# EAGLE design motor_node (EAGLE 9.6.2)

## Sheet 1 of 2
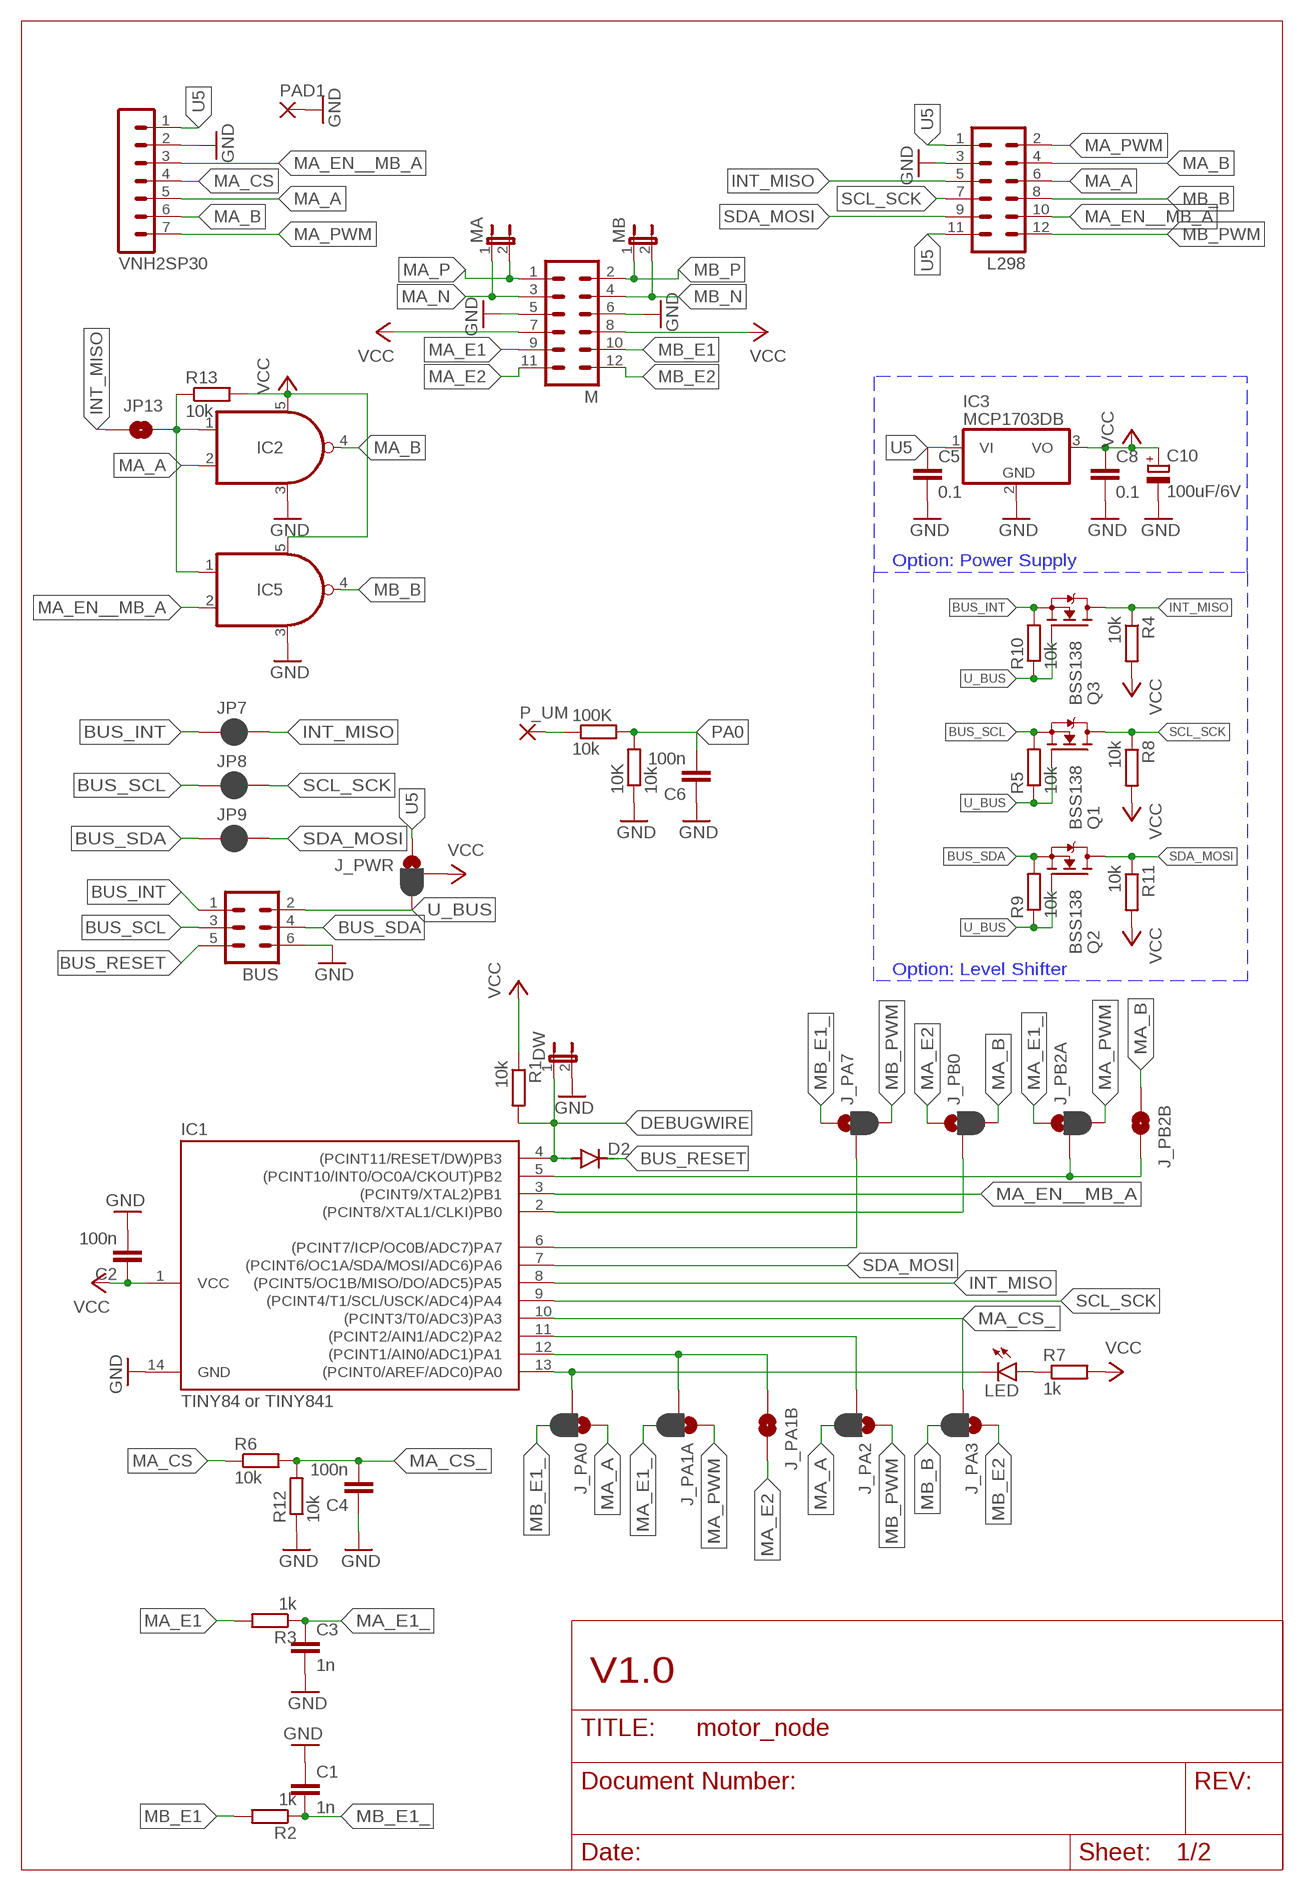
[diagram p0: schematic, sheet 1]

### Parts
10K  10k  R-EU_M0805  [M0805]
100K  10k  R-EU_M0805  [M0805]
BUS  ML6  [ML6]
C1  1n  C-EUC0805  [C0805]
C2  100n  C-EUC0805  [C0805]
C3  1n  C-EUC0805  [C0805]
C4  100n  C-EUC0805  [C0805]
C5  0.1  C-EUC0805  [C0805]
C6  100n  C-EUC0805  [C0805]
C8  0.1  C-EUC0805  [C0805]
C10  100uF/6V  CPOL-EUB/3528-21R  [B/3528-21R]
D2  DIODE-MINIMELF  [MINIMELF]
DW  JP1E  [JP1]
IC1  TINY84 or TINY841  TINY24/44/84-SSU  [SOIC14]
IC2  AHC00-DB  [SOT-23/5]
IC3  MCP1703DB  [SOT223]
IC5  AHC00-DB  [SOT-23/5]
J_PA0  JUMPER-SMT_3_1-NC_PASTE_NO-SILK  [SMT-JUMPER_3_1-NC_PASTE_NO-SILK]
J_PA1A  JUMPER-SMT_3_1-NC_PASTE_NO-SILK  [SMT-JUMPER_3_1-NC_PASTE_NO-SILK]
J_PA1B  JUMPER-SMT_2_NO_NO-SILK  [SMT-JUMPER_2_NO_NO-SILK]
J_PA2  JUMPER-SMT_3_1-NC_PASTE_NO-SILK  [SMT-JUMPER_3_1-NC_PASTE_NO-SILK]
J_PA3  JUMPER-SMT_3_1-NC_PASTE_NO-SILK  [SMT-JUMPER_3_1-NC_PASTE_NO-SILK]
J_PA7  JUMPER-SMT_3_1-NC_PASTE_NO-SILK  [SMT-JUMPER_3_1-NC_PASTE_NO-SILK]
J_PB0  JUMPER-SMT_3_1-NC_PASTE_NO-SILK  [SMT-JUMPER_3_1-NC_PASTE_NO-SILK]
J_PB2A  JUMPER-SMT_3_1-NC_PASTE_NO-SILK  [SMT-JUMPER_3_1-NC_PASTE_NO-SILK]
J_PB2B  JUMPER-SMT_2_NO_NO-SILK  [SMT-JUMPER_2_NO_NO-SILK]
J_PWR  JUMPER-SMT_3_1-NC_PASTE_NO-SILK  [SMT-JUMPER_3_1-NC_PASTE_NO-SILK]
JP7  JUMPER-SMT_2_NC_PASTE_NO-SILK  [SMT-JUMPER_2_NC_PASTE_NO-SILK]
JP8  JUMPER-SMT_2_NC_PASTE_NO-SILK  [SMT-JUMPER_2_NC_PASTE_NO-SILK]
JP9  JUMPER-SMT_2_NC_PASTE_NO-SILK  [SMT-JUMPER_2_NC_PASTE_NO-SILK]
JP13  JUMPER-SMT_2_NO_NO-SILK  [SMT-JUMPER_2_NO_NO-SILK]
L298  MA06-2  [MA06-2]
LED  LEDCHIPLED_0805  [CHIPLED_0805]
M  MA06-2  [MA06-2]
MA  JP1E  [JP1]
MB  JP1E  [JP1]
P_UM  1,6/0,8  [1,6/0,8]
PAD1  2,54/0,8  [2,54/0,8]
Q1  BSS138  [SOT23]
Q2  BSS138  [SOT23]
Q3  BSS138  [SOT23]
R1  10k  R-EU_M0805  [M0805]
R2  1k  R-EU_M0805  [M0805]
R3  1k  R-EU_M0805  [M0805]
R4  10k  R-EU_M0805  [M0805]
R5  10k  R-EU_R0805  [R0805]
R6  10k  R-EU_M0805  [M0805]
R7  1k  R-EU_R0603  [R0603]
R8  10k  R-EU_M0805  [M0805]
R9  10k  R-EU_R0805  [R0805]
R10  10k  R-EU_R0805  [R0805]
R11  10k  R-EU_M0805  [M0805]
R12  10k  R-EU_M0805  [M0805]
R13  10k  R-EU_R0805  [R0805]
VNH2SP30  MA07-1  [MA07-1]

### Nets
BUS_INT: BUS.1 JP7.1 Q3.2(S) R10.2
BUS_RESET: BUS.5 D2.C
BUS_SCL: BUS.3 JP8.1 Q1.2(S) R5.2
BUS_SDA: BUS.4 JP9.1 Q2.2(S) R9.2
DEBUGWIRE: D2.A DW.1 IC1.4((PCINT11/RESET/DW)PB3) R1.2
GND: 10K.1 BUS.6 C1.1 C2.2 C3.2 C4.1 C5.2 C6.1 C8.2 C10.- DW.2 IC1.14(GND) IC2.3(GND) IC3.2(GND) IC5.3(GND) L298.3 M.5 M.6 PAD1.1(P) R12.1 VNH2SP30.2
INT_MISO: IC1.8((PCINT5/OC1B/MISO/DO/ADC5)PA5) JP7.2 JP13.1 L298.5 Q3.3(D) R4.1
MA_A: IC2.2(I1) J_PA0.1 J_PA2.3 L298.6 VNH2SP30.5
MA_B: IC2.4(O) J_PB0.3 J_PB2B.1 L298.4 VNH2SP30.6
MA_CS: R6.1 VNH2SP30.4
MA_CS_: C4.2 IC1.10((PCINT3/T0/ADC3)PA3) J_PA3.2 R6.2 R12.2
MA_E1: M.9 R3.2
MA_E1_: C3.1 J_PA1A.3 J_PB2A.1 R3.1
MA_E2: J_PA1B.2 J_PB0.1 M.11
MA_EN__MB_A: IC1.3((PCINT9/XTAL2)PB1) IC5.2(I1) L298.10 VNH2SP30.3
MA_N [power]: M.3 MA.1
MA_P [power]: M.1 MA.2
MA_PWM: J_PA1A.1 J_PB2A.3 L298.2 VNH2SP30.7
MB_B: IC5.4(O) J_PA3.3 L298.8
MB_E1: M.10 R2.2
MB_E1_: C1.2 J_PA0.3 J_PA7.1 R2.1
MB_E2: J_PA3.1 M.12
MB_N [power]: M.4 MB.2
MB_P [power]: M.2 MB.1
MB_PWM: J_PA2.1 J_PA7.3 L298.12
N$2: 100K.1 P_UM.1(P)
N$4: IC2.1(I0) IC5.1(I0) JP13.2 R13.1
N$6: LED.A R7.1
PA0: 10K.2 100K.2 C6.2 IC1.13((PCINT0/AREF/ADC0)PA0) J_PA0.2 LED.C
PA1: IC1.12((PCINT1/AIN0/ADC1)PA1) J_PA1A.2 J_PA1B.1
PA2: IC1.11((PCINT2/AIN1/ADC2)PA2) J_PA2.2
PA7: IC1.6((PCINT7/ICP/OC0B/ADC7)PA7) J_PA7.2
PB0: IC1.2((PCINT8/XTAL1/CLKI)PB0) J_PB0.2
PB2: IC1.5((PCINT10/INT0/OC0A/CKOUT)PB2) J_PB2A.2 J_PB2B.2
SCL_SCK: IC1.9((PCINT4/T1/SCL/USCK/ADC4)PA4) JP8.2 L298.7 Q1.3(D) R8.1
SDA_MOSI: IC1.7((PCINT6/OC1A/SDA/MOSI/ADC6)PA6) JP9.2 L298.9 Q2.3(D) R11.1
U5: C5.1 IC3.1(VI) J_PWR.1 L298.1 L298.11 VNH2SP30.1
U_BUS: BUS.2 J_PWR.3 Q1.1(G) Q2.1(G) Q3.1(G) R5.1 R9.1 R10.1
VCC: C2.1 C8.1 C10.+ IC1.1(VCC) IC2.5(VDD) IC3.3(VO) IC5.5(VDD) J_PWR.2 M.7 M.8 R1.1 R4.2 R7.2 R8.2 R11.2 R13.2

### Notes on the sheet
- Option: Power Supply
- Option: Level Shifter
- V1.0

## Sheet 2 of 2

## Library data of the parts
10K 100K R1-R4 R6-R8 R11 R12 = rcl:R-EU_: RESISTOR, European symbol; SPICEPREFIX: R
BUS = con-harting-ml:ML6: HARTING; OC_FARNELL: unknown; OC_NEWARK: unknown
C1-C6 C8 = rcl:C-EU: CAPACITOR, European symbol
C10 = rcl:CPOL-EU: POLARIZED CAPACITOR, European symbol
D2 = diode:DIODE-: DIODE
DW MA MB = jumper:JP1E: JUMPER
IC1 = avr-7:TINY24/44/84
IC2 IC5 = picogate:AHC00: Two input NAND gate
IC3 = linear:MCP1703: 250 mA, 16V, Low Quiescent Current LDO Regulator Source: http://ww1.microchip.com/downloads/en/DeviceDoc/22049b.pdf
J_PA0 J_PA1A J_PA2 J_PA3 J_PA7 J_PB0 J_PB2A J_PWR = SparkFun-Jumpers:JUMPER-SMT_3_1-NC_PASTE: Normally closed solder jumper (1 of 2 connections) This jumper has an aperture in the stencil to allow solder paste to bridge one of the two connections. One connection is normally closed (NC), while the other is normally open (NO). Wick off the solder to open the connection. Reapply solder to reclose the connection. Apply solder to the other side instead to change the current path.
J_PA1B J_PB2B JP13 = SparkFun-Jumpers:JUMPER-SMT_2_NO: Normally open jumper This jumper has two pads in close proximity to each other. Apply solder to close the connection. Round pads are easier to solder for beginners, but are a lot larger. SparkFun Product that uses the round pads: SparkFun EL Sequencer <https://www.sparkfun.com/products/12781>
JP7-JP9 = SparkFun-Jumpers:JUMPER-SMT_2_NC_PASTE: Normally closed solder jumper This jumper has an aperture in the stencil to allow solder paste to bridge the split in the wire so it's normally closed (NC). Wick off the solder to open the connection. Reapply solder to reclose the connection.
L298 M = con-lstb:MA06-2: PIN HEADER; OC_FARNELL: unknown; OC_NEWARK: unknown
LED = led:LED: LED OSRAM: - CHIPLED LG R971, LG N971, LY N971, LG Q971, LY Q971, LO R971, LY R971 LH N974, LH R974 LS Q976, LO Q976, LY Q976 LO Q996 - Hyper CHIPLED LW Q18S LB Q993, LB Q99A, LB R99A - SideLED LS A670, LO A670, LY A670, LG A670, LP A670 LB A673, LV A673, LT A673, LW A673 LH A674 LY A675 LS A676, LA A676, LO A676, LY A676, LW A676 LS A679, LY A679, LG A679 - Hyper Micro SIDELED® LS Y876, LA Y876, LO Y876, LY Y876 LT Y87S - SmartLED LW L88C, LW L88S LB L89C, LB L89S, LG L890 LS L89K, LO L89K, LY L89K LS L896, LA L896, LO L896, LY L896 - TOPLED LS T670, LO T670, LY T670, LG T670, LP T670 LSG T670, LSP T670, LSY T670, LOP T670, LYG T670 LG T671, LOG T671, LSG T671 LB T673, LV T673, LT T673, LW T673 LH T674 LS T676, LA T676, LO T676, LY T676, LB T676, LH T676, LSB T676, LW T676 LB T67C, LV T67C, LT T67C, LS T67K, LO T67K, LY T67K, LW E67C LS E67B, LA E67B, LO E67B, LY E67B, LB E67C, LV E67C, LT E67C LW T67C LS T679, LY T679, LG T679 LS T770, LO T770, LY T770, LG T770, LP T770 LB T773, LV T773, LT T773, LW T773 LH T774 LS E675, LA E675, LY E675, LS T675 LS T776, LA T776, LO T776, LY T776, LB T776 LHGB T686 LT T68C, LB T68C - Hyper Mini TOPLED® LB M676 - Mini TOPLED Santana® LG M470 LS M47K, LO M47K, LY M47K Source: http://www.osram.convergy.de LUXEON: - LUMILED® LXK2-PW12-R00, LXK2-PW12-S00, LXK2-PW14-U00, LXK2-PW14-V00 LXK2-PM12-R00, LXK2-PM12-S00, LXK2-PM14-U00 LXK2-PE12-Q00, LXK2-PE12-R00, LXK2-PE12-S00, LXK2-PE14-T00, LXK2-PE14-U00 LXK2-PB12-K00, LXK2-PB12-L00, LXK2-PB12-M00, LXK2-PB14-N00, LXK2-PB14-P00, LXK2-PB14-Q00 LXK2-PR12-L00, LXK2-PR12-M00, LXK2-PR14-Q00, LXK2-PR14-R00 LXK2-PD12-Q00, LXK2-PD12-R00, LXK2-PD12-S00 LXK2-PH12-R00, LXK2-PH12-S00 LXK2-PL12-P00, LXK2-PL12-Q00, LXK2-PL12-R00 Source: www.luxeon.com KINGBRIGHT: KA-3528ASYC Source: www.kingbright.com
P_UM = wirepad:1,6/0,8: THROUGH-HOLE PAD
PAD1 = wirepad:2,54/0,8: THROUGH-HOLE PAD
Q1-Q3 = bss138_10:BSS138: BSS138 N-Channel Logic Level Enhancement Mode Field Effect Transistor Source: http://www.fairchildsemi.com/datasheets/BS/BSS138.pdf; MF: Fairchild; MPN: BSS138; OC_FARNELL: 9845330; OC_NEWARK: 67R2009
R5 R9 R10 R13 = rcl:R-EU_: RESISTOR, European symbol
VNH2SP30 = con-lstb:MA07-1: PIN HEADER; OC_FARNELL: unknown; OC_NEWARK: unknown

## Net classes
1 gnd: width 0.381 mm, drill 0.381 mm
2 power: width 0.762 mm, drill 0.762 mm

## Board
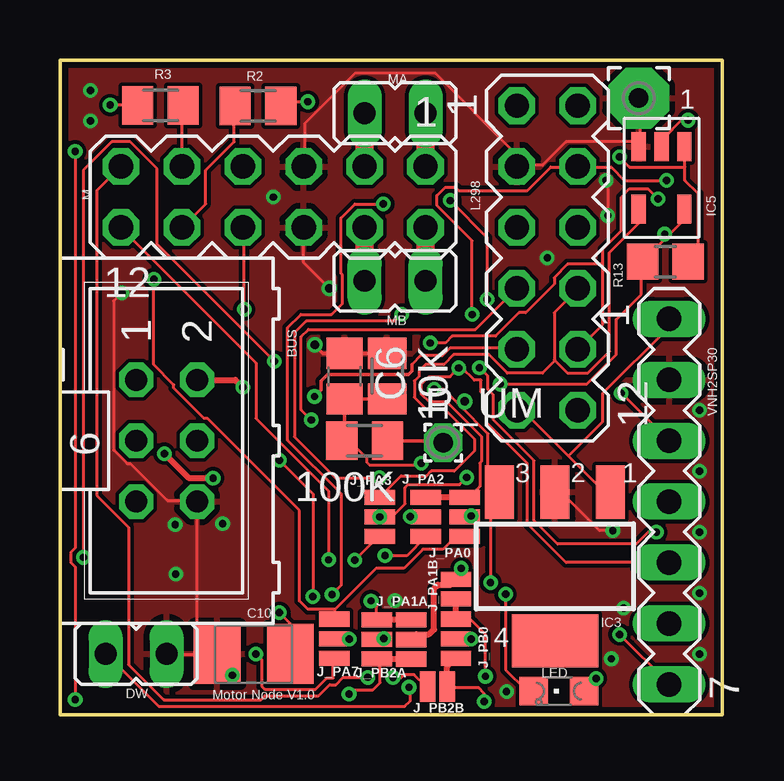
[diagram p1: board, top side]
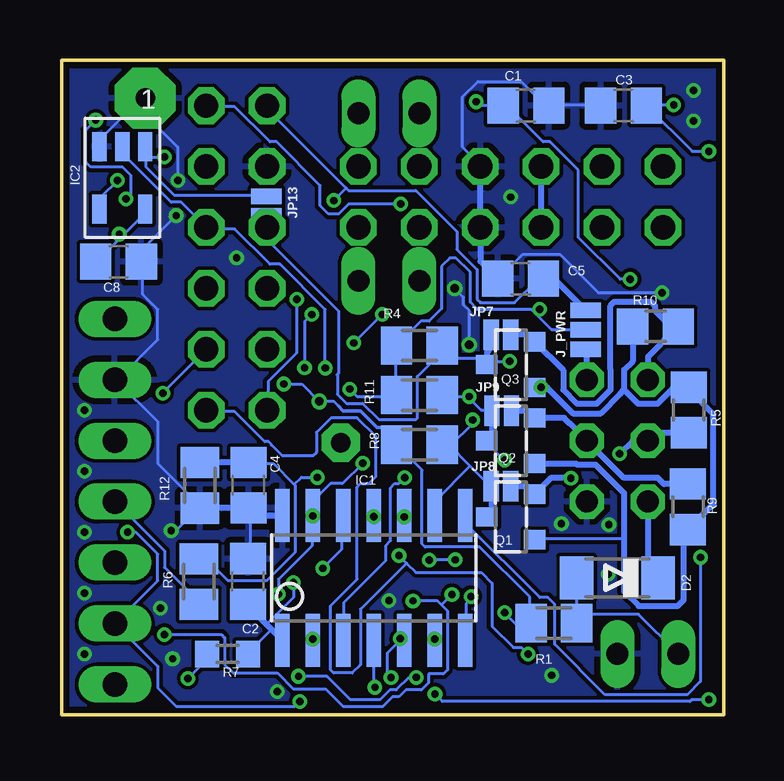
[diagram p2: board, bottom side, seen from below]

Size 27.62 x 27.3 mm. Coordinates in mm from the lower left corner, seen from the top.
Outline: 0,0 27.61,0 27.61,27.3 0,27.3 0,0
Outline: 0,0 27.62,0 27.62,27.3 0,27.3 0,0
Copper layers (1*16): Top 0.035mm / dielectric 1.5mm / Bottom 0.035mm
Design rules "eagle": minimum track width 5mil, minimum drill 12mil, track to track 6mil, track to pad 6mil, pad to pad 6mil, via to via 6mil, smd to smd 0mil, copper to edge 10mil, drill to drill 10mil, minimum pad ring 10mil, minimum via ring 6mil, stop-mask expansion 2mil, vias tented up to drill 25mil, thermal gap 10mil

### Footprints (pad centres in the part's own frame; a part is rotated, then mirrored left to right if it is on the bottom)
M0805 = smd 1.3 x 1.6: 1 -0.95,0; 2 0.95,0
ML6 = drill 0.914 octagon: 1 -2.54,-1.27; 2 -2.54,1.27; 3 0,-1.27; 4 0,1.27; 5 2.54,-1.27; 6 2.54,1.27
C0805 = smd 1.3 x 1.5: 1 -0.95,0; 2 0.95,0
B/3528-21R = smd 1.95 x 2.5: + 1.525,0; - -1.525,0
MINIMELF = smd 1.4 x 1.8: A 1.7,0; C -1.7,0
JP1 = drill 0.914 long: 1 0,-1.27; 2 0,1.27
SOIC14 = smd 0.61 x 2.21: 1 -3.81,-2.603; 2 -2.54,-2.603; 3 -1.27,-2.603; 4 0,-2.603; 5 1.27,-2.603; 6 2.54,-2.603; 7 3.81,-2.603; 8 3.81,2.603; 9 2.54,2.603; 10 1.27,2.603; 11 0,2.603; 12 -1.27,2.603; 13 -2.54,2.603; 14 -3.81,2.603
SOT-23/5 = smd 0.6 x 1.2: 1 -0.95,-1.306; 2 0,-1.306; 3 0.95,-1.306; 4 0.95,1.306; 5 -0.95,1.306
SOT223 = smd 1.219 x 2.235: 1 -2.311,-3.099; 2 0,-3.099; 3 2.311,-3.099 | smd 3.6 x 2.2: 4 0,3.099
SMT-JUMPER_3_1-NC_PASTE_NO-SILK = smd 0.635 x 1.27: 1 -0.813,0; 2 0,0; 3 0.813,0
SMT-JUMPER_2_NO_NO-SILK = smd 0.635 x 1.27: 1 -0.406,0; 2 0.406,0
SMT-JUMPER_2_NC_PASTE_NO-SILK = smd 0.635 x 1.27: 1 -0.406,0; 2 0.406,0
MA06-2 = drill 1.016 octagon: 1 -6.35,-1.27; 2 -6.35,1.27; 3 -3.81,-1.27; 4 -3.81,1.27; 5 -1.27,-1.27; 6 -1.27,1.27; 7 1.27,-1.27; 8 1.27,1.27; 9 3.81,-1.27; 10 3.81,1.27; 11 6.35,-1.27; 12 6.35,1.27
CHIPLED_0805 = smd 1.2 x 1.2: A 0,-1.05; C 0,1.05
1,6/0,8 = drill 0.813 pad 1.6 octagon: 1 0,0
2,54/0,8 = drill 0.813 pad 2.54 octagon: 1 0,0
SOT23 = smd 0.8 x 0.9: 1 -0.95,-1; 2 0.95,-1; 3 0,1
R0805 = smd 1.3 x 1.5: 1 -0.95,0; 2 0.95,0
R0603 = smd 1 x 1.1: 1 -0.85,0; 2 0.85,0
MA07-1 = drill 1.016 long: 1 -7.62,0; 2 -5.08,0; 3 -2.54,0; 4 0,0; 5 2.54,0; 6 5.08,0; 7 7.62,0

### Placement (x,y rotation side)
10K  13.64,14.12 270 top
100K  12.7,11.43 180 top
BUS  4.45,11.43 270 top
C1  8.26,25.4 180 bottom
C2  19.85,5.56 90 bottom
C3  4.19,25.41 180 bottom
C4  19.83,9.58 90 bottom
C5  8.48,18.19 180 bottom
C6  11.86,14.12 270 top
C8  25.24,18.89 0 bottom
C10  8.08,2.54 0 top
D2  4.45,5.71 180 bottom
DW  3.17,2.54 270 top
IC1  14.61,5.71 0 bottom
IC2  25.08,22.39 180 bottom
IC3  20.64,6.19 180 top
IC5  25.08,22.39 180 top
J_PA0  16.87,8.26 270 top
J_PA1A  14.64,3.14 270 top
J_PA1B  16.51,5.24 270 top
J_PA2  15.24,8.26 90 top
J_PA3  13.34,8.26 90 top
J_PA7  11.43,3.17 270 top
J_PB0  16.51,3.17 270 top
J_PB2A  13.21,3.15 90 top
J_PB2B  15.74,1.18 180 top
J_PWR  5.77,16.05 270 bottom
JP7  9.3,15.85 180 bottom
JP8  9.3,9.53 180 bottom
JP9  9.27,12.67 180 bottom
JP13  19.08,21.21 90 bottom
L298  20.32,19.05 270 top
LED  20.8,0.99 90 top
M  8.89,21.59 180 top
MA  13.97,25.08 270 top
MB  13.97,18.1 90 top
P_UM  15.98,11.35 0 top
PAD1  24.13,25.72 0 top
Q1  8.89,8.26 90 bottom
Q2  8.89,11.43 90 bottom
Q3  8.89,14.61 90 bottom
R1  7.09,3.82 0 bottom
R2  8.26,25.39 180 top
R3  4.19,25.41 0 top
R4  12.7,15.4 180 bottom
R5  1.47,12.71 270 bottom
R6  21.89,5.56 90 bottom
R7  20.7,2.54 0 bottom
R8  12.7,11.27 180 bottom
R9  1.5,8.67 90 bottom
R10  2.86,16.19 0 bottom
R11  12.7,13.34 180 bottom
R12  21.85,9.57 90 bottom
R13  25.24,18.89 180 top
VNH2SP30  25.4,8.89 270 top

### Tracks (layer width: path | path; a pad name or v marks a point on that pad's centre or on a via)
BUS_INT
  Bottom 0.254: R10.2 2.06,16.04 | 2.06,16.04 3.17,14.93 BUS.1 | 2.06,16.04 2.88,16.85 2.88,17.06 3.04,17.22 4.57,17.22 4.74,17.06 4.74,14.39 4.72,14.38 4.72,13.56 5.3,12.98 6.12,12.98 6.71,13.56 6.71,14.37 Q3.2 8.19,15.85 JP7.1
BUS_RESET
  Bottom 0.254: BUS.5 3.17,6.14 D2.C
BUS_SCL  (via drill 0.3)
  Top 0.254: v4.35,10.89 5.36,9.88 6.12,9.88 6.13,9.87 v6.38,9.87
  Bottom 0.254: R5.2 2.84,11.76 BUS.3 3.81,11.43 v4.35,10.89 | JP8.1 8.21,9.53 Q1.2 7.22,9.87 v6.38,9.87
BUS_SDA
  Bottom 0.254: R9.2 2.51,9.62 2.77,9.88 4.17,9.88 BUS.4 6.45,12.17 6.46,12.17 6.67,12.38 Q2.2 8.19,12.68 JP9.1
DEBUGWIRE  (via drill 0.3)
  Top 0.127: DW.1 1.96,2.52 4.12,0.35 14.37,0.35 14.61,0.58 14.61,1.1 v14.55,1.15
  Bottom 0.127: 6.15,4.19 6.15,5.66 D2.A | 6.15,4.19 6.15,3.84 R1.2 6.15,4.19 | 6.15,4.19 3.56,4.19 1.96,2.58 DW.1 | IC1.4 14.61,1.2 v14.55,1.15
GND  (via drill 0.3, 0.35)
  Top 0.127: IC3.2 20.89,9.29 22.49,7.68 v23.05,7.68 | 5.73,2.52 4.47,2.52 DW.2 | 5.73,2.52 6.5,2.52 C10.- | 5.73,2.52 5.73,8.87 BUS.6 5.66,8.94 4.47,8.94 2.93,10.48 2.79,10.48 2.23,11.04 2.23,17.25 v2.58,17.6 | 5.73,2.52 C10.- | 24.17,23.89 24.17,25.7 PAD1.1 | 24.17,23.89 24.17,23.75 IC5.3 24.17,23.89 | 24.17,23.89 21.09,23.89 20.12,22.91 19.07,22.91 L298.3 19,22.91 19,23.4 15.65,26.75 12.29,26.75 10.2,24.66 10.2,22.91 M.5 | v22.84,20.82 22.84,22.21 v22.77,22.28 | C10.- 7.19,1.9 v7.19,1.65 | v11.23,17.78 10.16,18.85 M.6
  Top 0.15: 10K.1 C6.1 10.98,15.07 v10.62,15.43
  Bottom 0.127: C2.2 19.77,6.64 19.77,8.03 19.56,8.24 C4.1 | v23.05,7.68 22.84,7.68 21.93,8.59 R12.1 21.86,8.73 23.61,10.48 23.61,12.22 25.36,13.97 VNH2SP30.2 25.29,13.97 23.61,15.65 23.61,16.9 24.24,17.53 24.24,18.86 C8.2 24.24,18.93 24.24,19.42 v22.84,20.82 | C3.2 5.17,25.43 7.26,25.43 C1.1 7.33,25.43 7.47,25.43 8.45,26.4 10.27,26.4 10.9,25.77 10.9,23.68 10.2,22.98 M.5 | IC2.3 25.98,23.75 25.98,24.03 24.31,25.7 24.17,25.7 PAD1.1 24.52,25.43 22.77,23.68 v22.77,22.28 | v2.58,17.6 5.24,17.6 6.84,19.21 8.38,19.21 9.36,18.23 C5.2 | v10.62,15.43 10.62,16.85 10.86,17.09 10.86,17.41 v11.23,17.78
  Bottom 0.254: M.5 M.6 10.16,18.91 C5.2 | IC1.14 19.52,8.32 C4.1 R12.1
  other vias: 4.83,5.87 4.8,7.92 6.78,7.98 1.27,24.77 1.27,26.04 8.89,21.59 20.32,19.05 26.67,12.7 26.67,10.16 26.67,7.62 26.67,5.08 26.67,2.54 13.97,4.76 18.62,0.97 22.99,2.34 23.5,4.45
  pour Top: 0,0 27.62,0 27.62,27.3 0,27.3
  pour Bottom: 0,0 27.62,0 27.62,27.3 0,27.3
INT_MISO  (via drill 0.3)
  Top 0.127: v0.98,6.57 0.98,22.7 2.17,23.89 2.93,23.89 4.05,22.77 4.05,19.63 v8.94,14.74
  Bottom 0.127: JP7.2 9.7,15.27 9.93,14.88 11.5,14.88 R4.1 11.8,15.37 11.8,15.09 12.78,14.11 12.78,12.65 12.78,12.37 12.83,12.32 14.39,12.32 15.06,12.99 15.75,12.99 16.12,13.37 16.12,14.17 16.14,14.18 16.07,14.25 16.07,16.83 19,19.77 19,20.26 L298.5 | v0.98,6.57 0.98,1.4 1.54,0.84 4.96,0.84 7.05,2.93 7.05,4.61 7.33,4.89 7.68,4.89 10.76,7.96 10.76,8.31 IC1.8 | v8.94,14.74 9.78,14.74 Q3.3
  Bottom 0.254: JP7.2 9.89,15.66 Q3.3 | L298.5 19.05,20.78 JP13.1
MA_A  (via drill 0.3)
  Top 0.127: VNH2SP30.5 25.36,6.36 21.09,6.36 19.49,7.96 19.49,10.48 17.79,12.18 17.79,13.23 17.56,13.46 17.56,13.96 17.27,13.96 16.77,14.46 v16.62,14.46 16.27,14.1 15.39,14.1 15.08,13.8 15.08,13.37 15.4,13.05 16.13,13.05 17.57,11.6 17.57,10.57 17.5,10.5 17.5,9.53 17.04,9.07 J_PA0.1 16.51,9.07
  Top 0.254: 16.51,9.07 J_PA2.3
  Bottom 0.127: IC2.2 25.08,23.68 25.08,23.4 23.05,21.37 22.63,21.37 L298.6 21.58,20.26 20.4,20.26 18.93,18.79 18.51,18.79 16.62,16.9 v16.62,14.46
MA_B  (via drill 0.3)
  Top 0.127: v25.29,22.28 23.54,22.28 22.98,22.84 21.65,22.84 L298.4 21.58,22.84 20.47,22.84 19.49,21.86 16.62,21.86 16.48,22 16.07,22 15.72,21.65 15.72,21.23 17.18,19.77 v17.18,16.69 | v17.68,0.56 17.68,0.9 17.46,1.12 16.2,1.12 J_PB2B.1 | v24.87,7.61 24.52,7.61 24.03,7.12 20.75,7.12 19.77,8.1 19.77,10.6 18.07,12.29 18.07,13.34 17.84,13.58 17.84,14.13 v17.49,14.48
  Top 0.254: J_PB2B.1 16.14,1.99 J_PB0.3
  Bottom 0.127: v25.29,22.28 25.98,21.58 25.98,21.09 IC2.4 | v17.68,0.56 17.89,0.35 22.84,0.35 23.61,1.12 23.61,2.03 25.36,3.77 VNH2SP30.6 25.36,3.84 23.61,5.59 23.61,6.71 24.52,7.61 v24.87,7.61 | v17.49,14.48 17.49,16.39 v17.18,16.69
MA_CS
  Bottom 0.127: R6.1 21.93,4.75 23.33,6.15 23.33,6.84 25.36,8.87 VNH2SP30.4
MA_CS_  (via drill 0.3)
  Top 0.127: J_PA3.2 IC1.10 13.9,8.31 14.39,8.8 14.39,9.47 14.52,9.6 16.66,9.6 v16.96,9.9
  Bottom 0.127: 17.92,9.6 18.79,10.48 19.77,10.48 C4.2 | 17.92,9.6 17.88,9.57 17.88,6.78 19.07,5.59 20.68,5.59 21.51,6.43 21.79,6.43 R6.2 | v16.96,9.9 17.62,9.9 17.92,9.6
  Bottom 0.254: J_PA3.2 IC1.10 | C4.2 R12.2
  other vias: 13.34,8.26
MA_E1
  Top 0.127: R3.2 5.1,25.36 5.1,22.91 M.9
MA_E1_  (via drill 0.3)
  Top 0.127: v2.1,25.43 3.21,25.43 C3.1 | v0.64,23.5 0.64,6.96 0.46,6.78 0.46,6.35 0.64,6.17 v0.64,0.64 | v12.05,0.87 12.22,1.04 13.05,1.04 13.35,1.35 13.35,1.78 13.34,1.8 13.34,2.34
  Top 0.254: J_PB2A.1 13.34,2.34 J_PA1A.3
  Bottom 0.127: v2.1,25.43 3.21,25.43 C3.1 1.33,23.5 v0.64,23.5 | v0.64,0.64 1.34,0.64 1.42,0.56 11.74,0.56 v12.05,0.87
MA_E2  (via drill 0.3)
  Top 0.127: v17.74,1.61 17.74,3.35 17.11,3.98 16.62,3.98 J_PB0.1 | M.11 2.52,22.84 1.54,21.86 1.54,9.15 2.86,7.82 2.86,2.1 4.33,0.63 8.38,0.63 8.54,0.8 10.78,0.8 11.24,1.26 11.5,1.26 11.81,1.56 v12.83,1.56
  Top 0.254: J_PB0.1 J_PA1B.2
  Bottom 0.127: v17.74,1.61 16.55,1.61 15.58,0.63 14.34,0.63 13.93,1.03 13.67,1.03 13.14,1.56 v12.83,1.56
MA_EN__MB_A  (via drill 0.3)
  Top 0.127: v26.19,24.8 25.91,24.8 25.15,24.03 25.15,23.75 IC5.2 | v24.94,21.51 24.52,21.93 23.75,21.93 23.4,21.58 23.4,20.19 22.63,19.42 22.63,18.79 | 22.63,18.79 22.63,16.27 21.65,15.3 L298.10 | v13.31,9.89 11.48,9.89 9.78,11.59 9.78,15.93 10.26,16.41 13.97,16.41 v14.25,16.69 | v15.44,15.51 16.07,15.51 16.34,15.79 18.16,15.79 19.14,16.76 19.42,16.76 20.61,17.95 20.61,18.23 21.16,18.79 22.63,18.79 | v23.4,13.41 25.36,11.46 VNH2SP30.3
  Bottom 0.127: v26.19,24.8 26.61,24.38 26.61,23.05 26.4,22.84 25.08,22.84 24.73,22.49 24.73,21.72 v24.94,21.51 | v15.44,15.51 v14.25,16.69 | IC1.3 15.86,3.14 15.86,4.68 14.11,6.43 14.11,7.05 13.9,7.26 13.9,9.47 13.73,9.64 13.56,9.64 v13.31,9.89 | v23.4,13.41 21.58,15.23 L298.10
MA_N
  Top 0.762: M.3 MA.1
MA_P
  Top 0.762: M.1 MA.2
MA_PWM  (via drill 0.3)
  Top 0.127: J_PB2A.3 13.21,4.51 v12.97,4.75 | v23.33,3.35 25.36,1.33 VNH2SP30.7 | v13.48,21.3 12.29,21.3 11.71,20.72 11.71,18.41 11.77,18.35 11.77,17.14 11.32,16.69 10.05,16.69 9.5,16.15 9.5,11.45 11.73,9.21 11.73,5.41 v11.34,5.02
  Top 0.254: J_PA1A.1 J_PB2A.3
  Bottom 0.127: v12.97,4.75 11.94,4.75 11.78,4.58 | 11.78,4.58 11.53,4.33 11.53,1.87 11.7,1.7 12.31,1.7 12.31,1.35 12.62,1.04 13.27,1.04 13.55,0.76 13.82,0.76 14.22,0.35 15.88,0.35 16.61,1.09 17.96,1.09 18.62,1.75 20.47,1.75 20.82,2.1 20.82,3.21 20.95,3.35 v23.33,3.35 | v13.48,21.3 15.65,21.3 16.07,20.89 16.48,20.89 16.83,21.23 16.83,22.07 18.65,23.89 18.93,23.89 20.4,25.36 21.58,25.36 L298.2 | 11.78,4.58 v11.34,5.02
MB_B
  Top 0.127: 20.64,14.77 20.61,14.81 20.61,16.76 21.58,17.74 L298.8 | 20.64,14.77 21.16,14.25 22,14.25 22.91,15.16 22.91,19.28 24.1,20.47 24.1,21.02 IC5.4 | 20.64,14.77 20.12,14.25 18.65,14.25 17.88,15.02 16.41,15.02 16,14.61 15.24,14.61 14.97,14.34 14.97,14.12 14.78,13.92 14.78,13.24 15.26,12.76 16.02,12.76 17.27,11.51 17.27,10.99 16.44,10.16 15.47,10.16 15.28,9.97 14.23,9.97 J_PA3.3
MB_E1
  Top 0.127: R2.2 7.26,25.36 7.26,23.89 6.08,22.7 6.08,21.3 5.1,20.33 M.10
MB_E1_  (via drill 0.3)
  Top 0.127: v10.34,25.57 9.36,25.57 9.22,25.43 R2.1 | 11.46,4.39 11.46,4.4 10.34,4.4 9.99,4.75 9.99,8.52 6.15,12.36 6.01,12.36 4.75,13.62 4.75,13.76 3.91,14.6 v3.91,18.16 | 11.46,4.39 11.46,4.05 J_PA7.1 | J_PA0.3 16.83,7.4 16.46,7.4 15.96,6.91 15.13,6.91 14.33,6.12 13.18,6.12 11.46,4.39
  Bottom 0.127: v10.34,25.57 10.2,25.43 9.22,25.43 C1.2 9.15,25.36 9.01,25.36 7.54,23.89 7.26,23.89 6.08,22.7 6.08,19.91 4.33,18.16 v3.91,18.16
MB_E2  (via drill 0.3)
  Top 0.127: v12.29,6.45 13.21,7.37 J_PA3.1 | v11.2,6.46 11.2,9.33 8.17,12.36 8.17,14.67 2.58,20.26 M.12
  Bottom 0.127: v12.29,6.45 11.21,6.45 v11.2,6.46
MB_N
  Top 0.762: MB.2 M.4
MB_P
  Top 0.762: MB.1 M.2
MB_PWM  (via drill 0.3)
  Top 0.127: v13.55,6.64 14.46,6.64 15.23,7.4 J_PA2.1 | J_PA7.3 11.39,2.31 11.39,1.54 11.13,1.54 10.67,1.07 8.54,1.07 8.41,1.2 8.41,2.3 v8.17,2.54
  Bottom 0.127: v13.55,6.64 13.24,6.32 | 13.24,6.32 12.85,5.93 10.12,5.93 9.67,5.49 9.67,3.69 8.78,2.81 8.44,2.81 v8.17,2.54 | 13.24,6.32 15.16,4.4 15.16,2.1 15.51,1.75 16.27,1.75 16.41,1.89 16.41,4.54 15.3,5.66 15.3,9.5 15.16,9.64 14.81,9.64 14.52,9.93 14.52,11.61 15.29,12.39 16.38,12.39 16.99,11.78 16.99,10.95 17.14,10.79 18.41,10.79 18.86,11.24 18.86,11.27 18.99,11.39 19.14,11.39 20.4,12.64 21.58,12.64 L298.12
N$2
  Top 0.15: 100K.1 15.9,11.43 P_UM.1
N$4  (via drill 0.3)
  Top 0.127: 26.05,22.84 26.05,22.28 26.61,21.72 26.61,19.35 26.19,18.93 R13.1 | 26.05,22.84 26.05,23.68 IC5.1 | 26.05,22.84 23.75,22.84 v23.33,23.26
  Bottom 0.127: 24.1,23.26 24.1,22.84 22.91,21.65 19.14,21.65 JP13.2 | 24.1,23.26 24.1,23.68 IC2.1 24.1,23.26 | 24.1,23.26 v23.33,23.26
N$6  (via drill 0.3)
  Top 0.127: v22.35,1.52 22.33,1.52 21.86,1.05 LED.A
  Bottom 0.127: R7.1 21.55,2.32 v22.35,1.52
PA0  (via drill 0.3)
  Top 0.127: v18.58,5.03 18.58,1.89 19.42,1.05 19.7,1.05 LED.C | 12.06,11.43 12.78,10.71 12.78,10.54 12.92,10.41 14.98,10.41 v15.06,10.49
  Top 0.15: 12.06,11.43 100K.2 11.86,11.54 C6.2 10K.2
  Top 0.254: J_PA0.2 17.11,8.26 v17.14,8.29
  Bottom 0.127: v18.58,5.03 18.58,5.66 17.18,7.05 17.18,8.17 IC1.13 17.14,8.89 | 17.14,9.11 17.14,8.89 | v15.06,10.49 15.91,9.64 16.4,9.64 17.14,8.89
  Bottom 0.254: v17.14,8.29 IC1.13
PA1  (via drill 0.3)
  Top 0.127: J_PA1B.1 16.73,5.87 v16.73,6.11
  Top 0.254: J_PA1A.2 14.86,3.36 15.39,3.36 15.6,3.56 15.6,5.27 15.76,5.43 16.29,5.43 J_PA1B.1
  Bottom 0.127: v16.73,6.11 15.93,6.92 15.93,8.31 IC1.12
PA2  (via drill 0.3)
  Top 0.254: v14.61,8.27 14.62,8.26 J_PA2.2
  Bottom 0.127: v14.61,8.27 IC1.11
PA7  (via drill 0.3)
  Top 0.254: J_PA7.2 12.05,3.17 v12.06,3.16
  Bottom 0.127: v12.06,3.16 12.08,3.14 IC1.6
PB0  (via drill 0.3)
  Top 0.254: J_PB0.2 17.13,3.17 v17.14,3.16
  Bottom 0.127: v17.14,3.16 17.18,3.14 IC1.2
PB2  (via drill 0.3)
  Top 0.127: v13.88,1.56 14.22,1.56 14.34,1.67 14.77,1.67 15.26,1.18 J_PB2B.2
  Top 0.254: J_PB2A.2 13.47,3.15 v13.49,3.17
  Bottom 0.127: IC1.5 13.55,3.07 14.04,2.58 14.04,1.71 v13.88,1.56
  Bottom 0.254: IC1.5 13.4,3.17 v13.49,3.17
SCL_SCK  (via drill 0.3)
  Top 0.127: v10.48,12.29 10.06,12.71 10.06,15.77 10.36,16.07 17.32,16.07 19,17.74 L298.7
  Bottom 0.127: 10.58,10.37 9.78,9.57 JP8.2 | 10.58,10.37 11.46,11.25 11.73,11.25 R8.1 11.39,11.25 10.48,12.15 v10.48,12.29 | 10.58,10.37 12.01,8.94 12.01,8.38 IC1.9
  Bottom 0.254: JP8.2 9.7,8.44 Q1.3
SDA_MOSI  (via drill 0.3)
  Top 0.127: L298.9 19,15.3 16.27,15.3 15.95,14.97 15.04,14.97 14.67,14.61 | v10.55,4.93 10.55,9.22 v9.15,10.62
  Top 0.152: v10.62,13.27 10.88,13.54 10.88,13.92 11.16,14.19 14.53,14.19 14.67,14.33 14.67,14.61
  Bottom 0.127: 10.65,13.24 10.69,13.27 11.73,13.27 R11.1 | 10.65,13.24 10.13,12.71 9.78,12.71 JP9.2 | v10.62,13.27 10.65,13.24 | v10.55,4.93 10.55,4.83 10.76,4.62 10.76,3.14 IC1.7 | v9.15,10.62 9.85,11.32 Q2.3
  Bottom 0.254: JP9.2 9.68,11.64 Q2.3
U5  (via drill 0.3)
  Top 0.127: IC3.1 22.7,9.29 21.2,10.79 | 21.2,10.79 19.35,12.64 19.07,12.64 L298.11 | 21.2,10.79 22.63,12.22 22.63,13.41 25.36,16.14 25.36,16.48 VNH2SP30.1 | v17.81,17.32 17.81,19.91 v16.27,21.44
  Bottom 0.127: 15.75,21.97 19,25.22 19,25.36 L298.1 | 15.75,21.97 15.65,21.86 12.85,21.86 11.14,20.15 11.14,19.41 10.3,18.57 10.3,17.32 10.16,17.18 8.73,17.18 7.82,18.09 7.61,18.09 C5.1 | v17.81,17.32 17.81,15.09 19,13.9 19,12.71 L298.11 | 15.75,21.97 v16.27,21.44
  Bottom 0.254: C5.1 7.09,18.19 J_PWR.1
U_BUS  (via drill 0.3)
  Top 0.254: BUS.2 7.3,13.97 v7.62,13.65
  Bottom 0.127: 4.17,7.33 7.82,7.33 Q1.1
  Bottom 0.254: BUS.2 5.71,15.19 J_PWR.3 | 4.17,13.56 4.17,14.38 3.81,14.74 R10.1 | 4.17,13.56 3.58,12.98 2.77,12.98 2.08,13.66 R5.1 1.47,13.56 0.44,12.53 0.44,8.79 R9.1 1.68,7.9 1.68,4.79 1.93,4.54 3.56,4.54 4.17,5.14 4.17,7.33 4.17,9.25 5.36,10.44 6.12,10.44 6.17,10.48 Q2.1 | Q3.1 v7.62,13.65 7.38,13.65 6.29,12.57 5.14,12.57 4.32,13.39 4.32,13.41 4.17,13.56
VCC  (via drill 0.3, 0.35)
  Top 0.127: v7.68,16.9 7.68,20.26 M.8 | v17.95,5.52 17.95,8.94 18.3,9.29 IC3.3 | 25.32,19.94 24.31,18.93 R13.2 24.24,18.86 24.24,17.53 23.19,16.48 23.19,15.02 21.96,13.79 v18.36,13.79 | 25.32,19.94 25.98,20.61 25.98,21.02 IC5.5 | v25.22,20.05 25.32,19.94 | v9.15,4.26 9.57,3.84 9.57,2.58 C10.+ | 18.23,9.99 18.23,9.29 IC3.3 | IC3.3 17.85,9.76 17.85,11.72 16.7,12.87 | 16.7,12.87 15.99,13.58 v15.6,13.58 | v16.88,13.07 16.88,13.04 16.7,12.87
  Bottom 0.127: 7.86,16.73 7.2,16.07 5.8,16.07 J_PWR.2 | 7.86,16.73 v7.68,16.9 | 18.86,3.56 19.84,2.58 R7.2 | 19.07,3.77 17.95,4.89 v17.95,5.52 | 25.11,19.94 26.12,18.93 C8.1 | 25.11,19.94 24.17,20.89 24.17,21.02 IC2.5 | 25.11,19.94 v25.22,20.05 | 13.67,11.99 13.65,11.97 R8.2 13.62,11.25 12.59,10.21 12.59,7.12 12.46,7 10.19,7 8.1,4.91 8.1,3.84 R1.1 8.71,3.82 v9.15,4.26 | v15.6,13.58 15.29,13.27 13.69,13.27 R11.2 13.69,13.34 13.69,15.37 R4.2 13.62,15.44 12.64,16.41 12.29,16.41 11.77,16.93 11.77,18.71 11.43,19.05 11.18,19.05 10.58,18.45 10.58,17.21 10.31,16.94 10.31,16.9 8.03,16.9 7.86,16.73 | 16.08,12.88 16.27,13.07 v16.88,13.07 17.6,13.79 v18.36,13.79
  Bottom 0.15: v18.36,13.79 18.34,13.81 | 13.67,11.99 14.48,11.99 15.16,12.68 15.88,12.68 16.08,12.88
  Bottom 0.254: M.8 M.7 | C2.1 19.85,4.55 19.07,3.77 18.86,3.56 IC1.1

### Text on the board
tNames: Motor Node V1.0